# EAGLE design rfid (EAGLE 8.3.1)
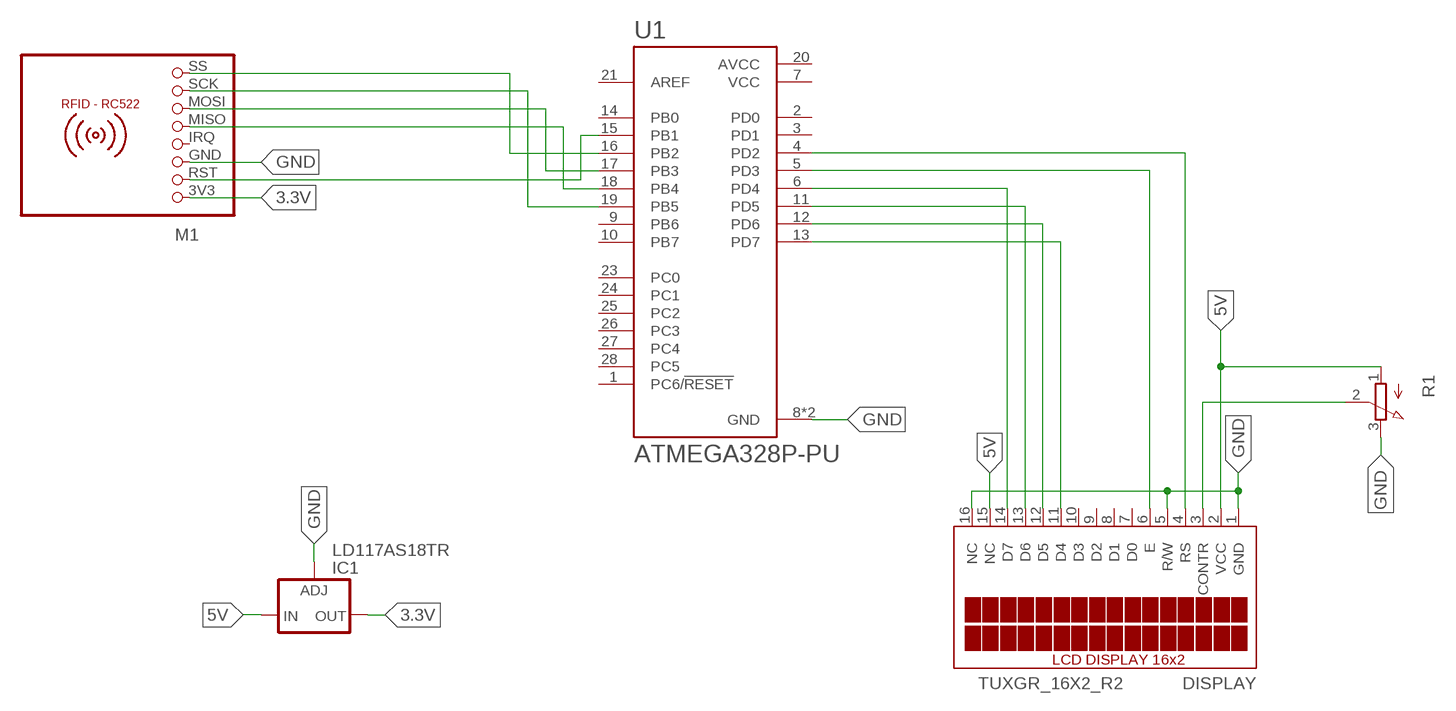
[diagram p0: schematic, sheet 1]

## Parts
DISPLAY  TUXGR_16X2_R2  [TUXGR_16X2_R2]
IC1  LD117AS18TR  [SOT223]
M1  RFID-RC522  [RFID-RC522]
R1  3RP/1610N  [3RP/1610N]
U1  ATMEGA328P-PU  [DIP794W46P254L2967H457Q28B]

## Nets
3.3V: IC1.4(OUT) M1.3V3
5V: DISPLAY.2(VCC) IC1.3(IN) R1.1(A)
GND: DISPLAY.1(GND) DISPLAY.5(R/W) DISPLAY.16(NC) IC1.1(ADJ) M1.GND R1.3(E) U1.8(GND) U1.22(GND)
N$1: M1.RST U1.15(PB1)
N$2: M1.MISO U1.18(PB4)
N$3: M1.MOSI U1.17(PB3)
N$4: M1.SCK U1.19(PB5)
N$5: M1.SS U1.16(PB2)
N$7: DISPLAY.3(CONTR) R1.2(S)
N$8: DISPLAY.4(RS) U1.4(PD2)
N$9: DISPLAY.6(E) U1.5(PD3)
N$10: DISPLAY.11(D4) U1.13(PD7)
N$11: DISPLAY.12(D5) U1.12(PD6)
N$12: DISPLAY.13(D6) U1.11(PD5)
N$13: DISPLAY.14(D7) U1.6(PD4)
N$14: DISPLAY.15(NC)
Unconnected: DISPLAY.7(D0) DISPLAY.8(D1) DISPLAY.9(D2) DISPLAY.10(D3) M1.IRQ U1.1(PC6/!RESET) U1.2(PD0) U1.3(PD1) U1.9(PB6) U1.10(PB7) U1.14(PB0) U1.21(AREF) U1.23(PC0) U1.24(PC1) U1.25(PC2) U1.26(PC3) U1.27(PC4) U1.28(PC5)

## Power pins joined to a net without a drawn wire
AVCC: U1.20(AVCC)
VCC: U1.7(VCC)

## Library data of the parts
DISPLAY = display-lcd:TUXGR_16X2_R2: Tuxgraphics LCD display 16x2 characters reflective, without background light Source: tuxgr_12x2_r2.pdf; OC_FARNELL: unknown; OC_NEWARK: unknown
IC1 = v-reg:LD117A?*: Low drop fixed and adjustable positive voltage regulators 1 A Source: http://www.st.com/stonline/products/literature/ds/7194/ld1117axx.pdf
M1 = mfrc522-module:RFID-RC522: RFID-RC522 MFRC-522 based breakout board
R1 = pot:3RP/1610N: 16mm Potentiometer one level Source: http://www.alphapotentiometers.net/html/16mm_pot_2.html
U1 = ATMEGA328P-PU:ATMEGA328P-PU: ATmega Series 20 MHz 32 KB Flash 2 KB SRAM 8-Bit Microcontroller - DIP-28; AVAILABILITY: Good; DESCRIPTION: Embedded microcontroller ATMEGA328P-PU PDIP 28 Microchip Technology 8-Bit 20 MHz I/O number 23; MF: Microchip; MP: ATMEGA328P-PU; PACKAGE: PDIP-28 Microchip; PRICE: 2.18 USD

## Net classes
0 default: width 0.305 mm, drill 0.508 mm, clearance 0.254 mm

## Board
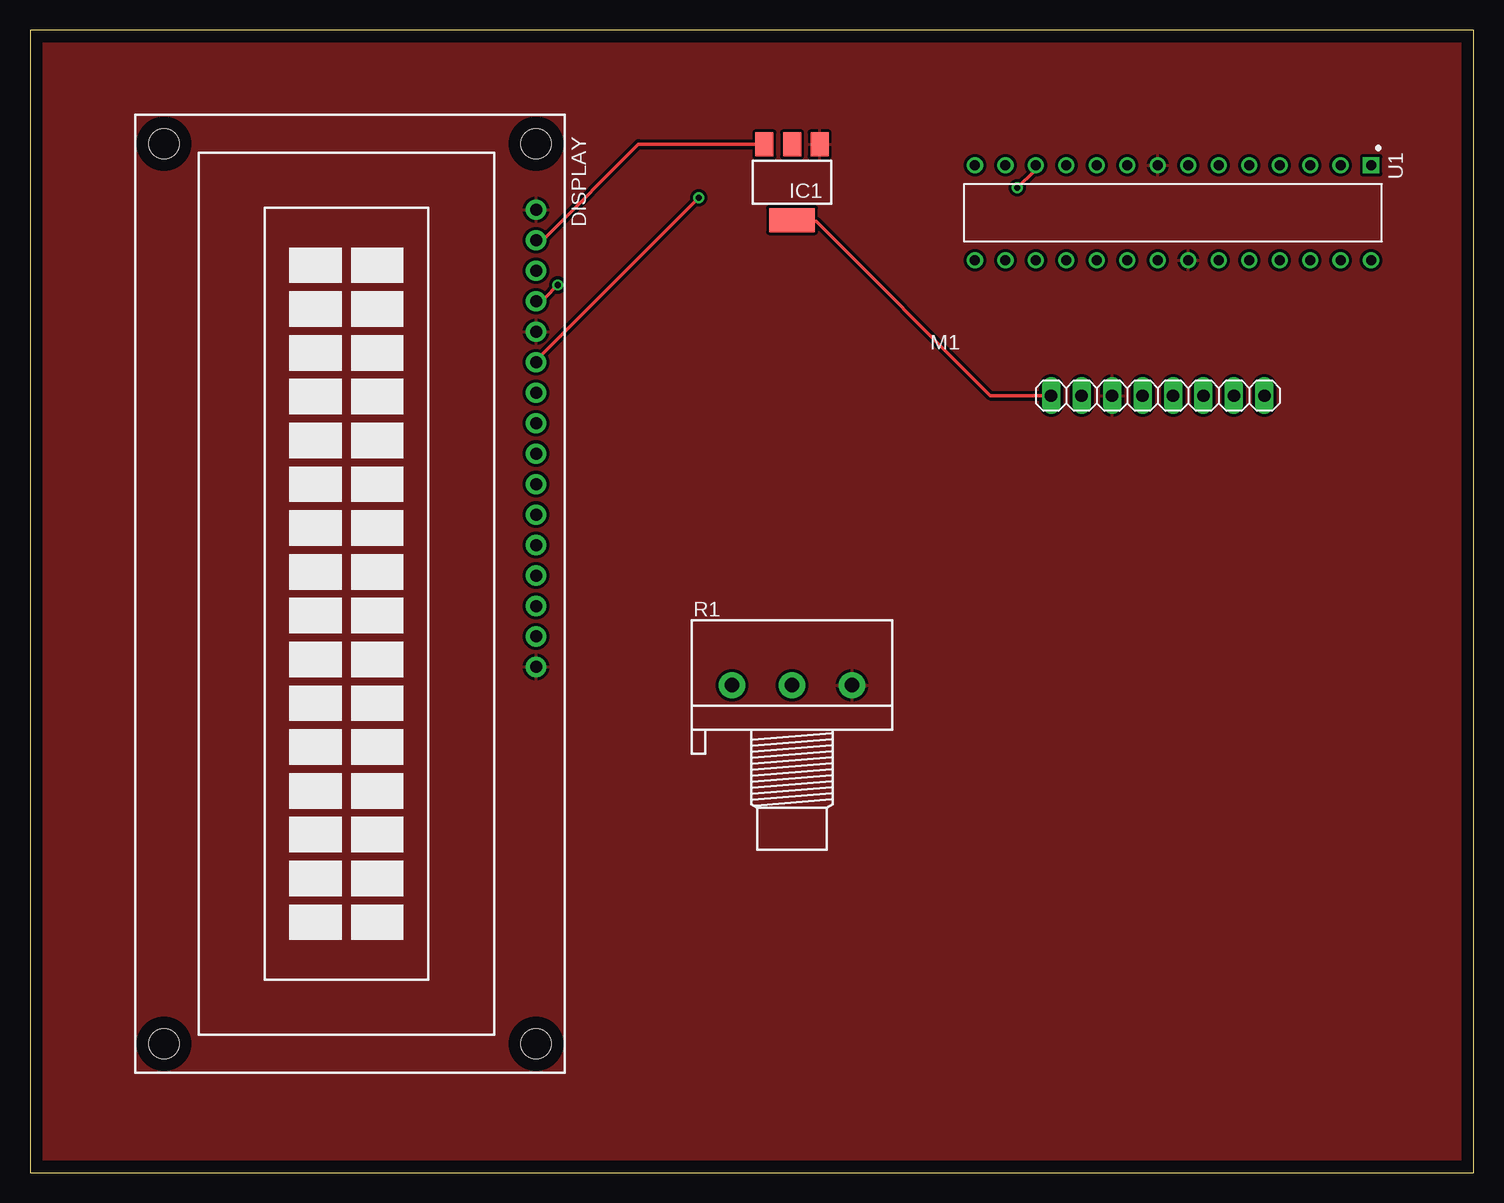
[diagram p1: board, top side]
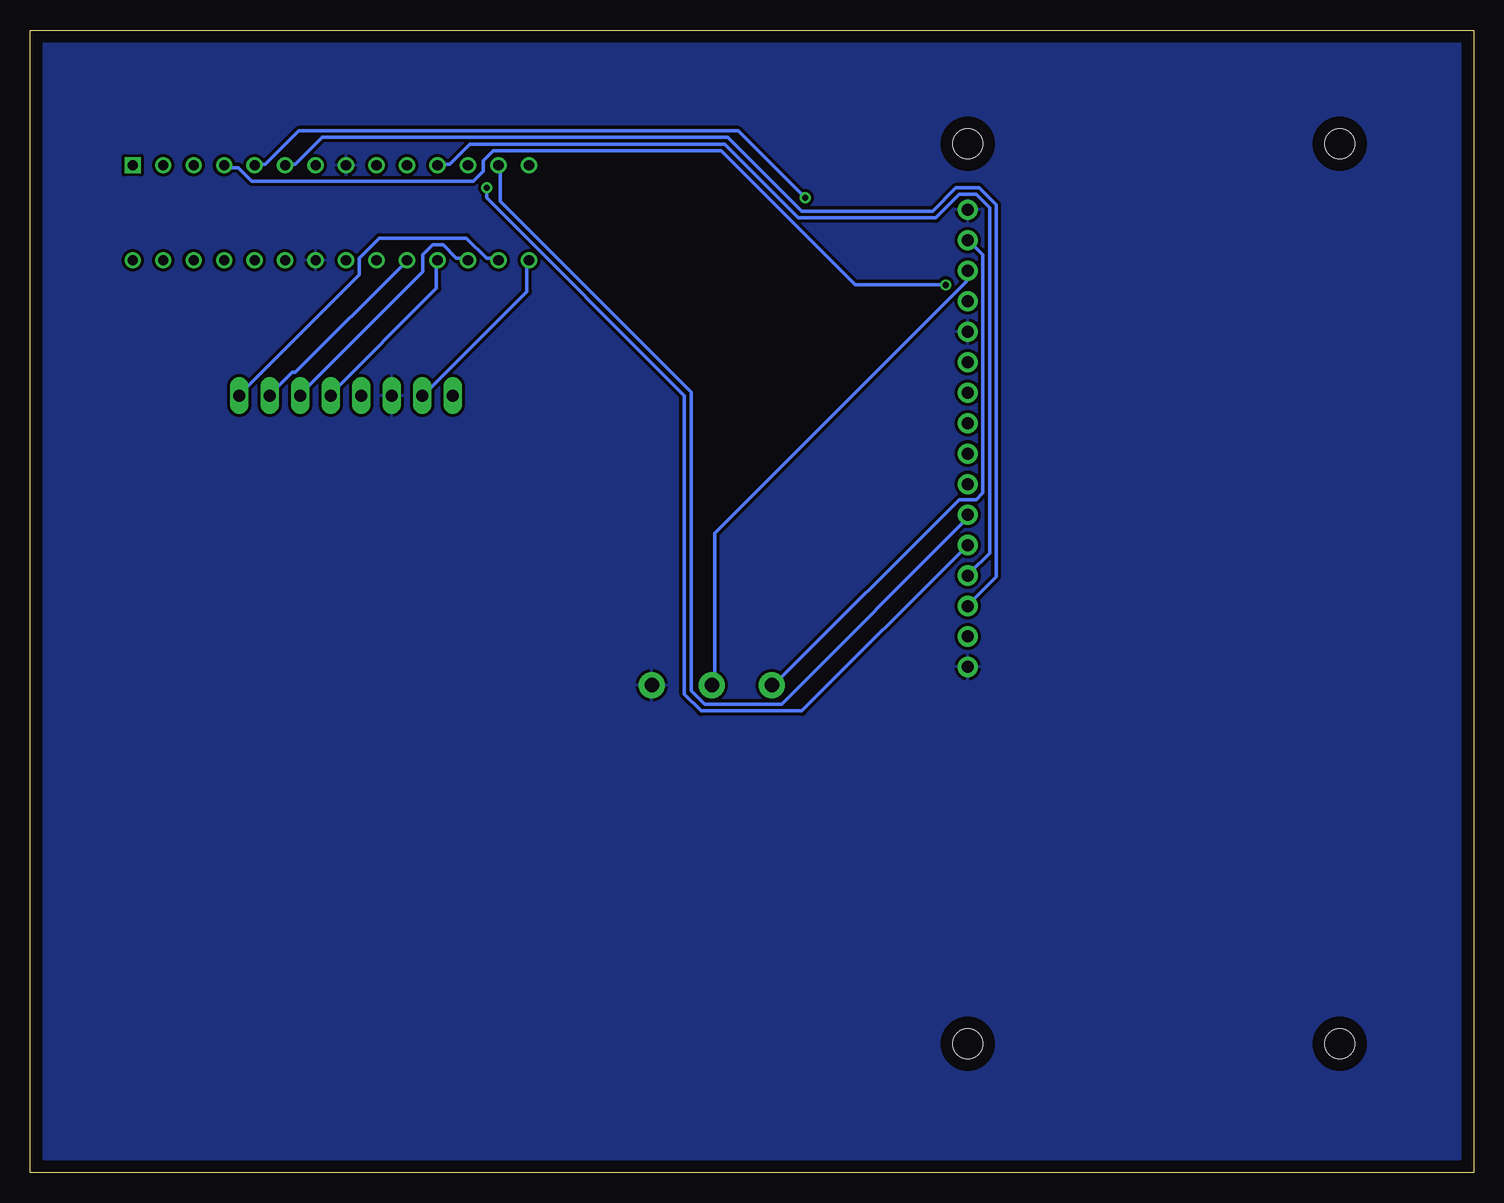
[diagram p2: board, bottom side, seen from below]

Size 120.32 x 95.24 mm. Coordinates in mm from the lower left corner, seen from the top.
Outline: 0,0 120.32,0 120.32,95.24 0,95.24 0,0
Copper layers (1*16): Top 0.035mm / dielectric 1.5mm / Bottom 0.035mm
Design rules "default": minimum track width 6mil, minimum drill 0.35mm, track to track 6mil, track to pad 6mil, pad to pad 6mil, via to via 6mil, smd to smd 6mil, copper to edge 40mil, drill to drill 6mil, minimum pad ring 10mil, minimum via ring 8mil, stop-mask expansion 4mil, vias tented up to drill 0mil, thermal gap 10mil

### Footprints (pad centres in the part's own frame; a part is rotated, then mirrored left to right if it is on the bottom)
TUXGR_16X2_R2 = drill 1 pad 1.676: 1 -32,15.5; 2 -29.46,15.5; 3 -26.92,15.5; 4 -24.38,15.5; 5 -21.84,15.5; 6 -19.3,15.5; 7 -16.76,15.5; 8 -14.22,15.5; 9 -11.68,15.5; 10 -9.14,15.5; 11 -6.6,15.5; 12 -4.06,15.5; 13 -1.52,15.5; 14 1.02,15.5; 15 3.56,15.5; 16 6.1,15.5 | hole 2.5: -37.5,-15.5; 37.5,-15.5; -37.5,15.5; 37.5,15.5
SOT223 = smd 1.5 x 2: 1 -2.3,-3.15; 2 0,-3.15; 3 2.3,-3.15 | smd 3.8 x 2: 4 0,3.15
RFID-RC522 = drill 1.016 long: 3V3 -8.89,0; GND -3.81,0; IRQ -1.27,0; MISO 1.27,0; MOSI 3.81,0; RST -6.35,0; SCK 6.35,0; SS 8.89,0
3RP/1610N = drill 1.2 pad 2.184: 1 -5,0; 2 0,0; 3 5,0
DIP794W46P254L2967H457Q28B = drill 0.85 square: 1 -3.96,16.51 | drill 0.85: 2 -3.96,13.97; 3 -3.96,11.43; 4 -3.96,8.89; 5 -3.96,6.35; 6 -3.96,3.81; 7 -3.96,1.27; 8 -3.96,-1.27; 9 -3.96,-3.81; 10 -3.96,-6.35; 11 -3.96,-8.89; 12 -3.96,-11.43; 13 -3.96,-13.97; 14 -3.96,-16.51; 15 3.96,-16.51; 16 3.96,-13.97; 17 3.96,-11.43; 18 3.96,-8.89; 19 3.96,-6.35; 20 3.96,-3.81; 21 3.96,-1.27; 22 3.96,1.27; 23 3.96,3.81; 24 3.96,6.35; 25 3.96,8.89; 26 3.96,11.43; 27 3.96,13.97; 28 3.96,16.51

### Placement (x,y rotation side)
DISPLAY  26.67,48.26 270 top
IC1  63.5,82.55 180 top
M1  93.98,64.77 0 top
R1  63.5,40.64 0 top
U1  95.25,80.01 270 top

### Tracks (layer width: path | path; a pad name or v marks a point on that pad's centre or on a via)
3.3V
  Top 0.305: M1.3V3 80.03,64.77 65.51,79.3 63.55,79.3 IC1.4
5V
  Top 0.305: IC1.3 61.04,85.72 50.7,85.72 42.88,77.9 42.32,77.9 DISPLAY.2
  Bottom 0.305: R1.1 58.24,40.74 42.88,56.11 41.48,56.11 40.92,56.67 40.92,76.5 42.04,77.62 DISPLAY.2
GND
  pour Top: -1.27,96.52 -1.27,-1.27 121.92,-1.27 121.92,96.52
  pour Bottom: -1.27,96.52 -1.27,-1.27 121.92,-1.27 121.92,96.52
N$1
  Bottom 0.305: U1.15 78.92,75.95 78.92,73.43 87.58,64.77 M1.RST
N$2
  Bottom 0.305: U1.18 86.46,75.95 86.46,73.71 95.4,64.77 M1.MISO
N$3
  Bottom 0.305: U1.17 83.95,76.22 84.78,76.22 85.9,77.34 86.74,77.34 87.58,76.5 87.58,75.11 97.92,64.77 M1.MOSI
N$4
  Bottom 0.305: U1.19 88.98,75.95 98.2,66.73 98.48,66.73 100.43,64.77 M1.SCK
N$5
  Bottom 0.305: U1.16 81.43,76.22 82.27,76.22 83.95,77.9 91.21,77.9 92.89,76.22 92.89,74.83 102.95,64.77 M1.SS
N$7
  Bottom 0.305: DISPLAY.3 42.32,75.11 42.32,74.27 63.27,53.31 63.27,40.74 R1.2
N$8  (via drill 0.51)
  Top 0.305: v43.99,73.99 42.88,72.87 42.32,72.87 DISPLAY.4
  Bottom 0.305: v43.99,73.99 51.54,73.99 62.71,85.17 81.71,85.17 82.55,84.33 82.55,83.49 83.39,82.65 101.83,82.65 102.95,83.77 104.06,83.77 U1.4
N$9  (via drill 0.51)
  Top 0.305: v55.73,81.25 42.04,67.56 DISPLAY.6
  Bottom 0.305: v55.73,81.25 61.32,86.84 97.92,86.84 100.71,84.05 101.55,84.05 U1.5
N$10
  Bottom 0.305: U1.13 81.15,83.77 81.15,80.97 65.23,65.05 65.23,40.18 64.11,39.06 57.68,39.06 42.04,54.71 DISPLAY.11
N$11  (via drill 0.51)
  Top 0.305: v82.27,82.09 83.67,83.49 83.67,83.77 U1.12
  Bottom 0.305: v82.27,82.09 82.27,81.25 65.79,64.77 65.79,39.9 64.39,38.51 56.01,38.51 42.32,52.2 DISPLAY.12
N$12
  Bottom 0.305: U1.11 86.18,84.05 85.34,84.05 83.67,85.72 62.43,85.72 56.29,79.58 44.83,79.58 42.88,81.53 41.48,81.53 40.36,80.42 40.36,51.64 42.04,49.96 DISPLAY.13
N$13
  Bottom 0.305: U1.6 99.03,84.05 98.2,84.05 95.96,86.28 62.15,86.28 56.01,80.14 45.11,80.14 43.16,82.09 41.2,82.09 39.8,80.7 39.8,49.68 42.04,47.45 DISPLAY.14